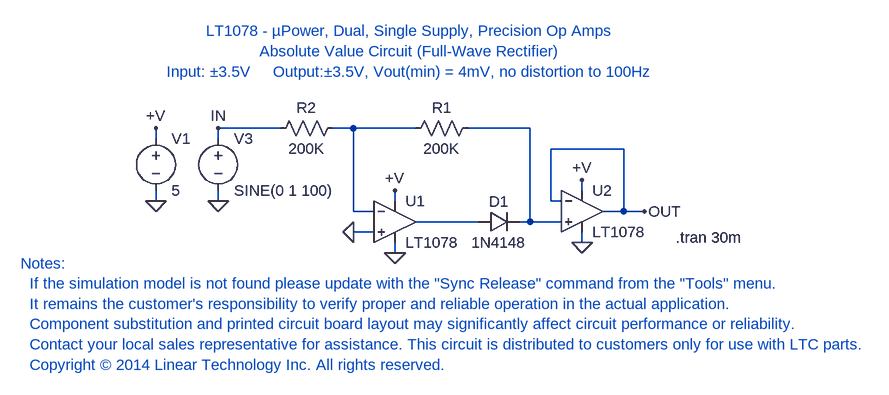
[diagram p0: schematic LT1078_TA08.asc]
LT1078_TA08.asc, the LTspice schematic file:
Version 4
SHEET 1 1428 680
WIRE 16 96 -80 96
WIRE 128 96 96 96
WIRE 224 96 128 96
WIRE 400 96 304 96
WIRE -176 112 -176 96
WIRE -80 112 -80 96
WIRE 544 128 432 128
WIRE 480 192 480 176
WIRE -176 208 -176 192
WIRE -80 208 -80 192
WIRE 192 208 192 192
WIRE 432 208 432 128
WIRE 448 208 432 208
WIRE 128 224 128 96
WIRE 160 224 128 224
WIRE 544 224 544 128
WIRE 544 224 512 224
WIRE 576 224 544 224
WIRE 320 240 224 240
WIRE 400 240 400 96
WIRE 400 240 384 240
WIRE 448 240 400 240
WIRE 160 256 128 256
WIRE 480 272 480 256
WIRE 192 288 192 272
FLAG -176 208 0
FLAG 192 192 +V
FLAG -176 96 +V
FLAG -80 208 0
FLAG 192 288 0
FLAG 480 176 +V
FLAG 480 272 0
FLAG -80 96 IN
FLAG 576 224 OUT
FLAG 128 256 0
SYMBOL voltage -176 96 R0
SYMATTR InstName V1
SYMATTR Value 5
SYMBOL res 320 80 R90
WINDOW 0 0 56 VBottom 2
WINDOW 3 32 56 VTop 2
SYMATTR InstName R1
SYMATTR Value 200K
SYMBOL res 112 80 R90
WINDOW 0 0 56 VBottom 2
WINDOW 3 32 56 VTop 2
SYMATTR InstName R2
SYMATTR Value 200K
SYMBOL voltage -80 96 R0
SYMATTR InstName V3
SYMATTR Value SINE(0 1 100)
SYMBOL LT1078 192 176 R0
SYMATTR InstName U1
SYMBOL diode 320 256 R270
WINDOW 0 32 32 VTop 2
WINDOW 3 0 32 VBottom 2
SYMATTR InstName D1
SYMATTR Value 1N4148
SYMBOL LT1078 480 160 R0
SYMATTR InstName U2
TEXT 624 264 Left 2 !.tran 30m
TEXT 216 24 Bottom 2 ;LT1078 - µPower, Dual, Single Supply, Precision Op Amps\nAbsolute Value Circuit (Full-Wave Rectifier)\nInput: ±3.5V     Output:±3.5V, Vout(min) = 4mV, no distortion to 100Hz
TEXT -384 304 Left 2 ;Notes:\n  If the simulation model is not found please update with the "Sync Release" command from the "Tools" menu.\n  It remains the customer's responsibility to verify proper and reliable operation in the actual application.\n  Component substitution and printed circuit board layout may significantly affect circuit performance or reliability.\n  Contact your local sales representative for assistance. This circuit is distributed to customers only for use with LTC parts.\n  Copyright © 2014 Linear Technology Inc. All rights reserved.

The netlist it stands for:
* LT1078_TA08.asc
V1 +V 0 5
R1 N002 N001 200K
R2 N001 IN 200K
V3 IN 0 SINE(0 1 100)
* U1: LT1078 (symbol LT1078 not available, pins judged from their places): In+=0 In-=N001 V+=+V V-=0 OUT=N003
D1 N003 N002 1N4148
* U2: LT1078 (symbol LT1078 not available, pins judged from their places): In+=N002 In-=OUT V+=+V V-=0 OUT=OUT
.model D D
.lib standard.dio
.tran 30m
* LT1078 - µPower, Dual, Single Supply, Precision Op Amps
* Absolute Value Circuit (Full-Wave Rectifier)
* Input: ±3.5V     Output:±3.5V, Vout(min) = 4mV, no distortion to 100Hz
* Notes:
*   If the simulation model is not found please update with the "Sync Release" command from the "Tools" menu.
*   It remains the customer's responsibility to verify proper and reliable operation in the actual application.
*   Component substitution and printed circuit board layout may significantly affect circuit performance or reliability.
*   Contact your local sales representative for assistance. This circuit is distributed to customers only for use with LTC parts.
*   Copyright © 2014 Linear Technology Inc. All rights reserved.
.backanno
.end